# EAGLE design Toslink_Transceiver_V3 (EAGLE 9.5.2)
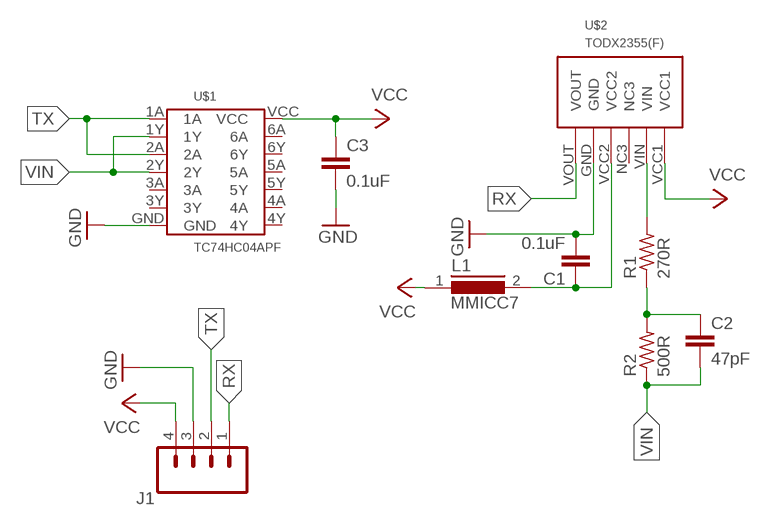
[diagram p0: schematic, sheet 1]

## Parts
C1  0.1uF  C2.5/2  [C2.5-2]
C2  47pF  C2.5/2  [C2.5-2]
C3  0.1uF  C2.5/2  [C2.5-2]
J1  CONN_04  [1X04]
L1  MMICC7  [MMICC7]
R1  270R  R-US_0204/5  [0204/5]
R2  500R  R-US_0204/5  [0204/5]
U$1  TC74HC04APF  [DIP14-P-300-2.54]
U$2  TODX2355(F)  [TODX2355(F)]

## Nets
GND: C1.2 C3.2 J1.3 U$1.GND U$2.GND
N$1: C1.1 L1.2 U$2.VCC2
N$2: R1.2 U$2.VIN
N$3: C2.1 R1.1 R2.2
RX: J1.1 U$2.VOUT
TX: J1.2 U$1.1A U$1.2A
VCC: C3.1 J1.4 L1.1 U$1.VCC U$2.VCC1
VIN: C2.2 R2.1 U$1.1Y U$1.2Y
Unconnected: U$1.3A U$1.3Y U$1.4A U$1.4Y U$1.5A U$1.5Y U$1.6A U$1.6Y U$2.NC3

## Library data of the parts
C1-C3 = capacitor-wima:C: CAPACITOR naming: grid - package width
J1 = SparkFun-Connectors:CONN_04: Multi connection point. Often used as Generic Header-pin footprint for 0.1 inch spaced/style header connections On any of the 0.1 inch spaced packages, you can populate with these: Break Away Headers - Straight <https://www.sparkfun.com/products/116> (PRT-00116) Break Away Male Headers - Right Angle <https://www.sparkfun.com/products/553> (PRT-00553) Female Headers <https://www.sparkfun.com/products/115> (PRT-00115) Break Away Headers - Machine Pin <https://www.sparkfun.com/products/117> (PRT-00117) Break Away Female Headers - Swiss Machine Pin <https://www.sparkfun.com/products/743> (PRT-00743) For SCREWTERMINALS and SPRING TERMINALS visit here: Screw Terimnals on SparkFun.com <https://www.sparkfun.com/search/results?term=Screw+Terminals> (5mm/3.5mm/2.54mm spacing) This device is also useful as a general connection point to wire up your design to another part of your project. Our various solder wires solder well into these plated through hole pads. Hook-Up Wire - Assortment (Stranded, 22 AWG) <https://www.sparkfun.com/products/11375> (PRT-11375) Hook-Up Wire - Assortment (Solid Core, 22 AWG) <https://www.sparkfun.com/products/11367> (PRT-11367) View the entire wire category on our website here <https://www.sparkfun.com/categories/141> Special notes: Molex polarized connector foot print use with SKU : PRT-08231 with associated crimp pins and housings. 1MM SMD Version SKU: PRT-10208; PROD_ID: CONN-09696
L1 = inductors:MMICC7: INDUCTOR; SPICEPREFIX: L
R1 R2 = adafruit:R-US_: RESISTOR, American symbol
U$1 = TOSLink_Transceiver:TC74HC04APF
U$2 = TOSLink_Transceiver:TODX2355(F)

## Board
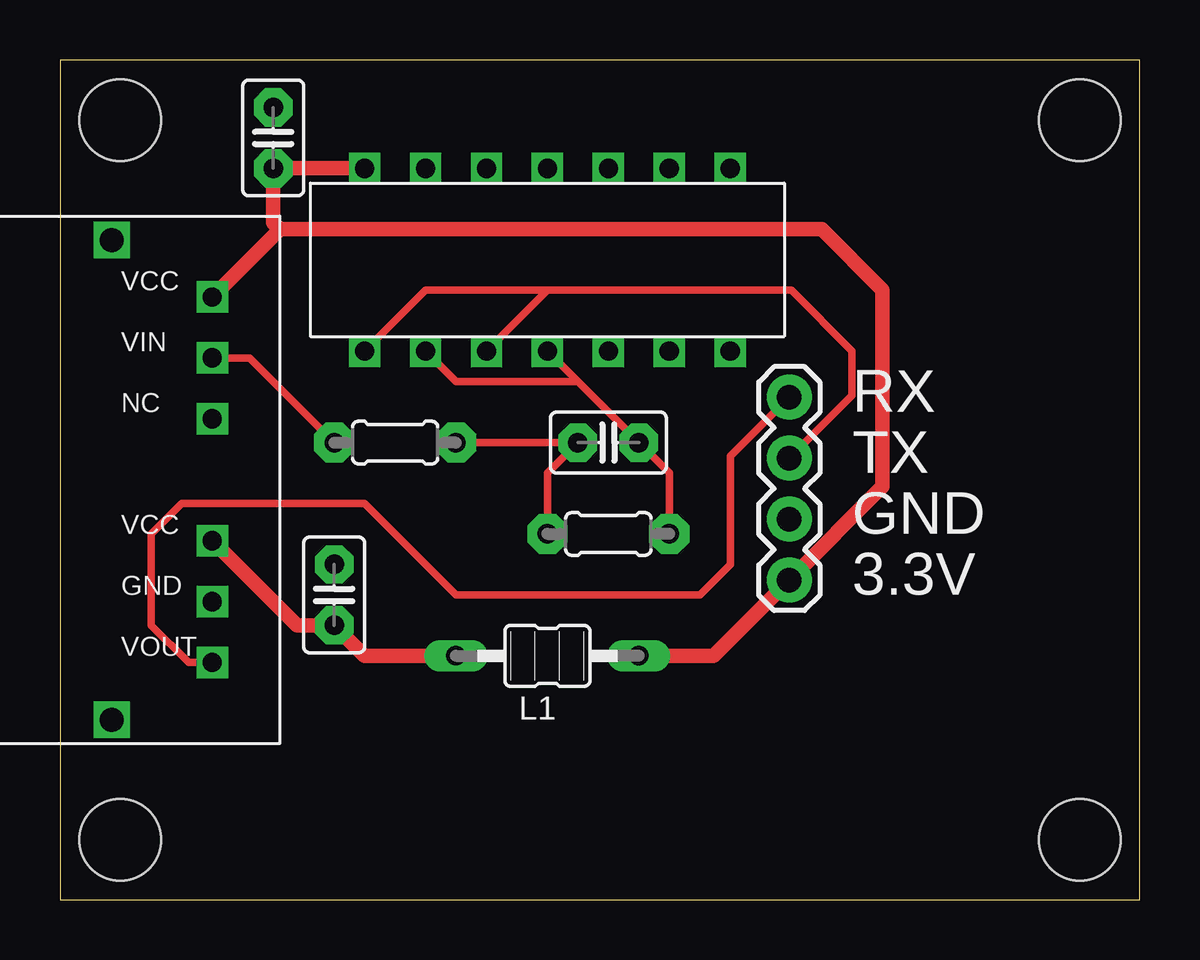
[diagram p1: board, top side]
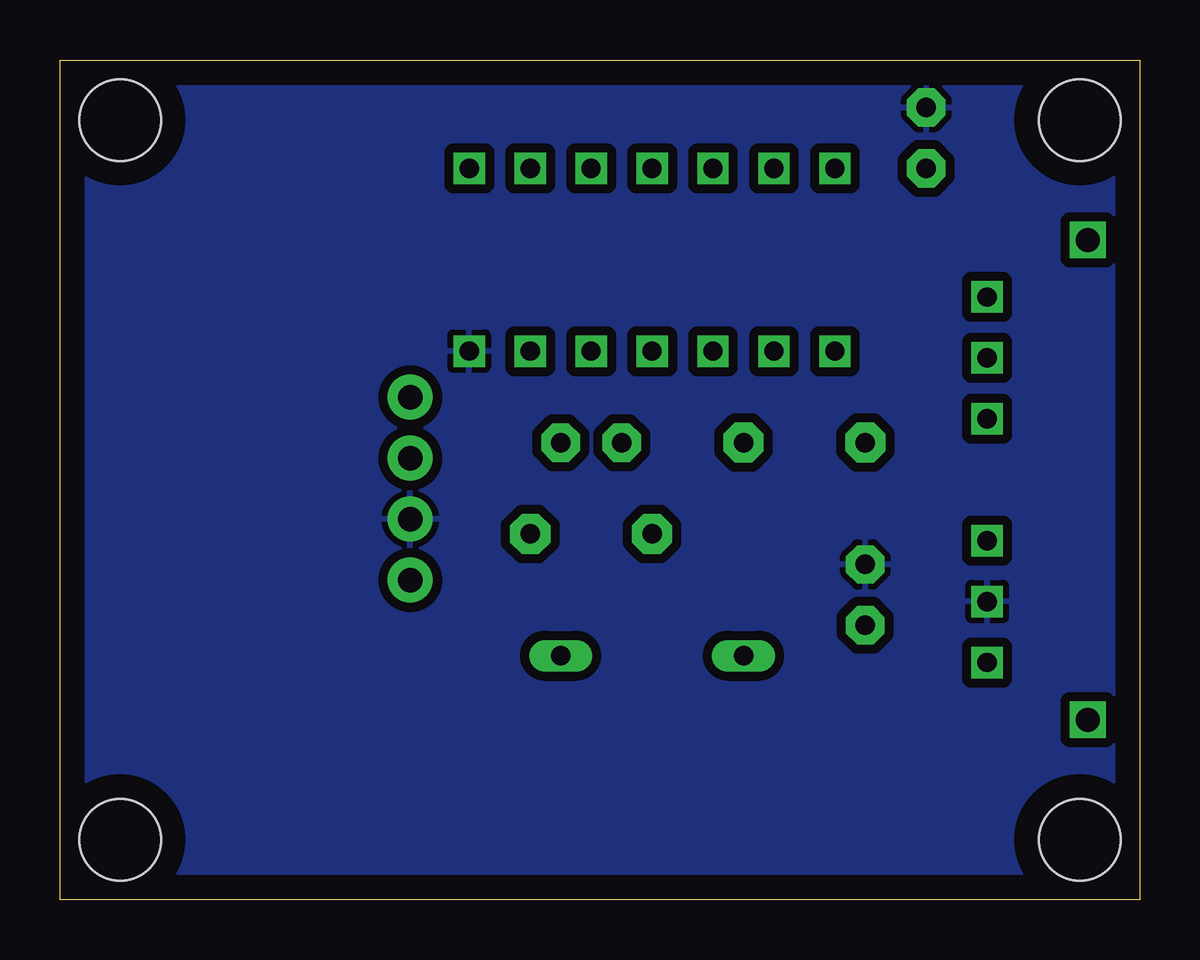
[diagram p2: board, bottom side, seen from below]

Size 45 x 35 mm. Coordinates in mm from the lower left corner, seen from the top.
Outline: 0,0 45,0 45,35 0,35 0,0
Copper layers (1*16): Top 0.035mm / dielectric 1.5mm / Bottom 0.035mm
Design rules "default *": minimum track width 6mil, minimum drill 0.35mm, track to track 15mil, track to pad 15mil, pad to pad 15mil, via to via 15mil, smd to smd 15mil, copper to edge 40mil, drill to drill 15mil, minimum pad ring 10mil, minimum via ring 8mil, stop-mask expansion 4mil, vias tented up to drill 0mil, thermal gap 10mil
Holes 3.4 mm at 2.5,32.5 42.5,32.5 42.5,2.5 2.5,2.5

### Footprints (pad centres in the part's own frame; a part is rotated, then mirrored left to right if it is on the bottom)
C2.5-2 = drill 0.813 pad 1.6 octagon: 1 -1.27,0; 2 1.27,0
1X04 = drill 1.016 pad 1.88: 1 0,0; 2 2.54,0; 3 5.08,0; 4 7.62,0
MMICC7 = drill 0.813 long: 1 -3.81,0; 2 3.81,0
0204/5 = drill 0.813 pad 1.676 octagon: 1 -2.54,0; 2 2.54,0
DIP14-P-300-2.54 = drill 0.8 square: 1A -3.81,7.62; 1Y -3.81,5.08; 2A -3.81,2.54; 2Y -3.81,0; 3A -3.81,-2.54; 3Y -3.81,-5.08; 4A 3.81,-5.08; 4Y 3.81,-7.62; 5A 3.81,0; 5Y 3.81,-2.54; 6A 3.81,5.08; 6Y 3.81,2.54; GND -3.81,-7.62; VCC 3.81,7.62
TODX2355(F) = drill 0.8 square: GND -5.08,0; NC3 2.54,0; VCC1 7.62,0; VCC2 -2.54,0; VIN 5.08,0; VOUT -7.62,0 | drill 1 square: NC1 -10,4.2; NC2 10,4.2

### Placement (x,y rotation side)
C1  11.43,12.7 90 top
C2  22.86,19.05 0 top
C3  8.89,31.75 90 top
J1  30.4,20.94 270 top
L1  20.32,10.16 180 top
R1  13.97,19.05 180 top
R2  22.86,15.24 180 top
U$1  20.32,26.67 90 top
U$2  6.35,17.5 90 top

### Tracks (layer width: path | path; a pad name or v marks a point on that pad's centre or on a via)
GND
  pour Bottom: -5.08,36.83 46.99,36.83 46.99,-2.54 -5.08,-2.54
N$1
  Top 0.61: L1.2 12.7,10.16 C1.1 9.88,11.43 U$2.VCC2
N$2
  Top 0.305: R1.2 7.9,22.58 U$2.VIN
N$3
  Top 0.305: R1.1 C2.1 20.32,17.78 R2.2
RX
  Top 0.305: J1.1 27.94,18.48 27.94,13.97 26.67,12.7 16.51,12.7 12.7,16.51 5.08,16.51 3.81,15.24 3.81,11.43 5.36,9.88 U$2.VOUT
TX
  Top 0.305: J1.2 33.02,21.02 33.02,22.86 30.48,25.4 20.32,25.4 | 20.32,25.4 17.78,25.4 15.24,25.4 U$1.1A | 20.32,25.4 U$1.2A
VCC
  Top 0.61: L1.1 27.24,10.16 J1.4 34.29,17.21 34.29,25.4 31.75,27.94 9.17,27.94 | 9.17,27.94 U$2.VCC1 | 9.17,27.94 8.89,28.22 C3.1 U$1.VCC
VIN
  Top 0.305: U$1.1Y 16.51,21.59 21.59,21.59 | 21.59,21.59 C2.2 25.4,17.78 R2.1 | U$1.2Y 21.59,21.59

### Text on the board
tNames: VCC | VIN | NC | RX | TX | VCC | GND | GND | 3.3V | VOUT